# Altium schematic sheet LevelShifter.SchDoc
size A4; SheetNumber: 6; SheetTotal: 6
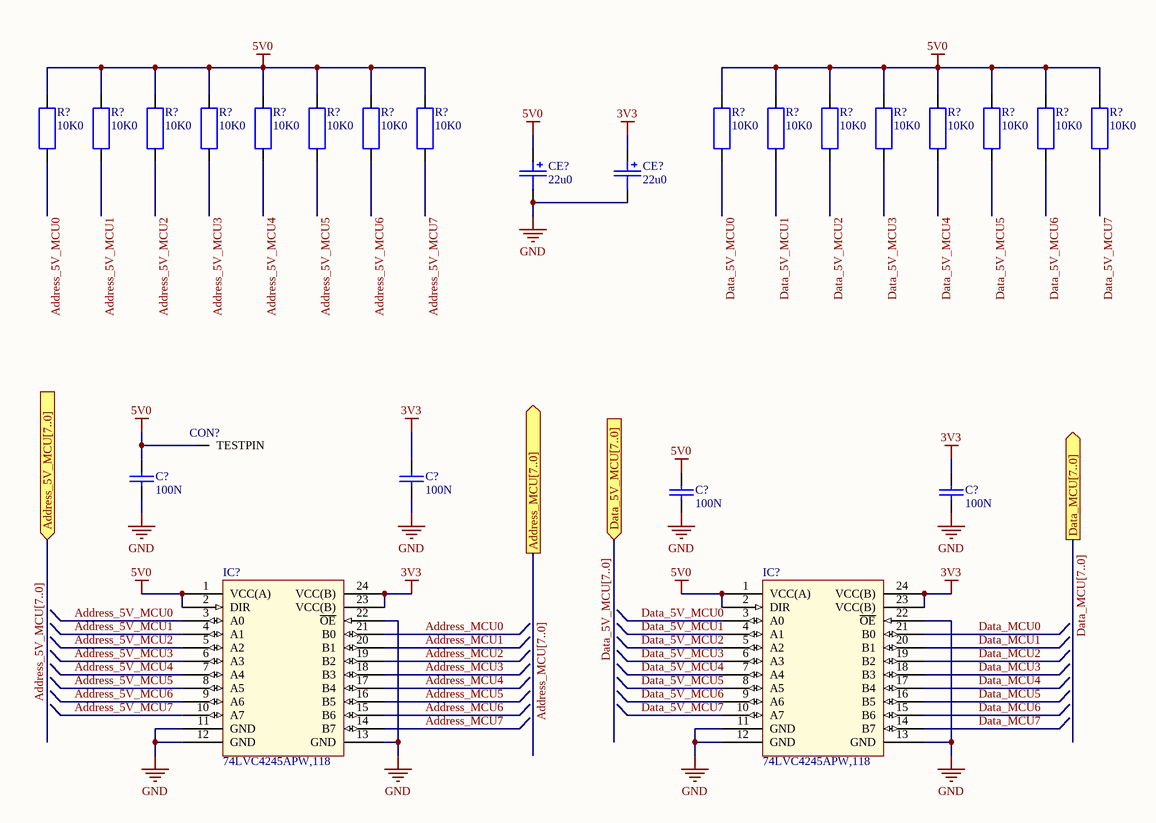
[diagram p0: LevelShifter.SchDoc]

## Parts
(Parts that share a designator on the sheet are numbered #1, #2 ... from top to bottom, then left to right.)
C?#1  capacitance: 100N  [0603_C]  (hidden comment: CC)
C?#2  capacitance: 100N  [0603_C]  (hidden comment: CC)
C?#3  capacitance: 100N  [0603_C]  (hidden comment: CC)
C?#4  capacitance: 100N  [0603_C]  (hidden comment: CC)
CE?#1  22u0  [CE_002_THT_2MM20_S_A]
CE?#2  22u0  [CE_002_THT_2MM20_S_A]
CON?  CON_001_M_MM000_S_X_MILL-MAX_TP  [CON_001_THT_MM000_S_D]  (value not drawn)
IC?#1  entity_name: 74LVC4245APW,118  [TSSOP24]  (hidden comment: IC_74LVC4245APW118_TSSOP24)
IC?#2  entity_name: 74LVC4245APW,118  [TSSOP24]  (hidden comment: IC_74LVC4245APW118_TSSOP24)
R?#1  resistance: 10K0  [0603_A]  (hidden comment: RS)
R?#2  resistance: 10K0  [0603_A]  (hidden comment: RS)
R?#3  resistance: 10K0  [0603_A]  (hidden comment: RS)
R?#4  resistance: 10K0  [0603_A]  (hidden comment: RS)
R?#5  resistance: 10K0  [0603_A]  (hidden comment: RS)
R?#6  resistance: 10K0  [0603_A]  (hidden comment: RS)
R?#7  resistance: 10K0  [0603_A]  (hidden comment: RS)
R?#8  resistance: 10K0  [0603_A]  (hidden comment: RS)
R?#9  resistance: 10K0  [0603_A]  (hidden comment: RS)
R?#10  resistance: 10K0  [0603_A]  (hidden comment: RS)
R?#11  resistance: 10K0  [0603_A]  (hidden comment: RS)
R?#12  resistance: 10K0  [0603_A]  (hidden comment: RS)
R?#13  resistance: 10K0  [0603_A]  (hidden comment: RS)
R?#14  resistance: 10K0  [0603_A]  (hidden comment: RS)
R?#15  resistance: 10K0  [0603_A]  (hidden comment: RS)
R?#16  resistance: 10K0  [0603_A]  (hidden comment: RS)

## Ports
Address_5V_MCU[7..0] (in), Address_MCU[7..0] (out), Data_5V_MCU[7..0] (in), Data_MCU[7..0] (out)

## Nets
3V3: C?#2.1 C?#4.1 CE?#2.1 IC?#1.23(VCC(B)) IC?#1.24(VCC(B)) IC?#2.23(VCC(B)) IC?#2.24(VCC(B))
5V0: C?#1.1 C?#3.1 CE?#1.1 CON?.1(TESTPIN) IC?#1.1(VCC(A)) IC?#1.2(DIR) IC?#2.1(VCC(A)) IC?#2.2(DIR) R?#1.2 R?#2.2 R?#3.2 R?#4.2 R?#5.2 R?#6.2 R?#7.2 R?#8.2 R?#9.2 R?#10.2 R?#11.2 R?#12.2 R?#13.2 R?#14.2 R?#15.2 R?#16.2
GND: C?#1.2 C?#2.2 C?#3.2 C?#4.2 CE?#1.2 CE?#2.2 IC?#1.11(GND) IC?#1.12(GND) IC?#1.13(GND) IC?#1.22(~{OE}) IC?#2.11(GND) IC?#2.12(GND) IC?#2.13(GND) IC?#2.22(~{OE})
Address_5V_MCU0: IC?#1.3(A0) R?#1.1
Address_5V_MCU1: IC?#1.4(A1) R?#2.1
Address_5V_MCU2: IC?#1.5(A2) R?#3.1
Address_5V_MCU3: IC?#1.6(A3) R?#4.1
Address_5V_MCU4: IC?#1.7(A4) R?#5.1
Address_5V_MCU5: IC?#1.8(A5) R?#6.1
Address_5V_MCU6: IC?#1.9(A6) R?#7.1
Address_5V_MCU7: IC?#1.10(A7) R?#8.1
Address_MCU0: IC?#1.21(B0)
Address_MCU1: IC?#1.20(B1)
Address_MCU2: IC?#1.19(B2)
Address_MCU3: IC?#1.18(B3)
Address_MCU4: IC?#1.17(B4)
Address_MCU5: IC?#1.16(B5)
Address_MCU6: IC?#1.15(B6)
Address_MCU7: IC?#1.14(B7)
Data_5V_MCU0: IC?#2.3(A0) R?#9.1
Data_5V_MCU1: IC?#2.4(A1) R?#10.1
Data_5V_MCU2: IC?#2.5(A2) R?#11.1
Data_5V_MCU3: IC?#2.6(A3) R?#12.1
Data_5V_MCU4: IC?#2.7(A4) R?#13.1
Data_5V_MCU5: IC?#2.8(A5) R?#14.1
Data_5V_MCU6: IC?#2.9(A6) R?#15.1
Data_5V_MCU7: IC?#2.10(A7) R?#16.1
Data_MCU0: IC?#2.21(B0)
Data_MCU1: IC?#2.20(B1)
Data_MCU2: IC?#2.19(B2)
Data_MCU3: IC?#2.18(B3)
Data_MCU4: IC?#2.17(B4)
Data_MCU5: IC?#2.16(B5)
Data_MCU6: IC?#2.15(B6)
Data_MCU7: IC?#2.14(B7)

## Buses and harness runs
bus Address_5V_MCU[7..0] = port Address_5V_MCU[7..0]
bus Address_MCU[7..0] = port Address_MCU[7..0]
bus Data_5V_MCU[7..0] = port Data_5V_MCU[7..0]
bus Data_MCU[7..0] =  = port Data_MCU[7..0]

## Library data of the parts
C?#1-C?#4 = X_00004988: manufacturer: Kemet; entity_name: CC_0603_100N_50V0_10P0_X7R_Kemet; entity_type_name: capacitor_ceramic; temp_coefficient: X7R; release: blocked; max_operating_temp: 125C; min_operating_temp: -55C; tolerance: 10P0; voltage_rated: 50V0; ordering_information_btm: 801-5347; used_in_bom: 0; production_status: Aktiv; x2e_number: X_00004988; height: mm800; width: mm800; length: 1mm60; package: 0603; series: none
CE?#1 CE?#2 = CE_RADIAL_22U_50V0_20PO_R07: Teapo Elko TA Series 22µF 50V
CON? = X_00001838: MILL-MAX_TP; ordering_information: digikey, ED90581-ND; entity_type_name: connector; release: blocked; max_operating_temp: 0C; grid: MM000; pin_count_type: X; mounting_type: S; gender: M; number_of_electronic_pins: 001; ordering_information_btm: ED90581-ND; used_in_bom: 1; production_status: Aktiv; editor_date: boos, 06.02.2014; x2e_number: X_00001838; entity_name: CON_001_M_MM000_S_X_MILL-MAX_TP; height: 5mm56; width: 3mm18; length: 3mm18; min_operating_temp: 0C; manufacturer: MILL-MAX; package: THT; shell_material: Tin; series: 2501
IC?#1 IC?#2 = IC_74LVC4245APW118_TSSOP24: ic, logic, bus switch, level shifter; manufacturer: IDT; manufacture_name: IDTQS3384QG8; ordering_information: digikey, 800-1739-1-ND; x2e_number: X_00000794; propagation_delay: 250P; data_rate: bps000; number_of_channels: 001; release: blocked; number_of_bits: 010; max_operating_temp: 85C; min_operating_temp: -40C; vcc_max: 5V25; vcc_min: 4V75; ordering_information_btm: 800-1739-2-ND; used_in_bom: 1; production_status: Aktiv; entity_type_name: levelshifter; output_type: logic; input_type: logic; height: 1mm73; width: 3mm90; length: 8mm89; series: none; package: SSOP24; revision: none
R?#1-R?#16 = X_00000001: manufacturer: Yageo; entity_name: RS_0603_10K0_W100_1P00_100PPM; entity_type_name: resistor_standard; power: W100; temp_coefficient: 100PPM; tolerance: 1P00; release: blocked; max_operating_temp: 125C; min_operating_temp: -55C; ordering_information_btm: 311-10.0KHRCT-ND; used_in_bom: 1; production_status: Aktiv; x2e_number: X_00000001; series: RC0603; height: mm450; width: mm800; length: 1mm60; package: 0603